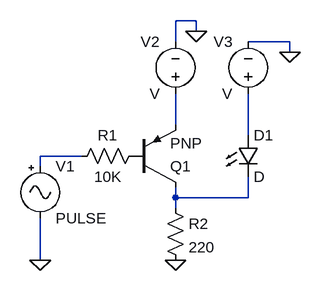
[diagram p0: schematic Draft2.asc]
Draft2.asc, the LTspice schematic file:
Version 4
SHEET 1 880 680
WIRE 240 -80 208 -80
WIRE 240 -64 240 -80
WIRE 208 -48 208 -80
WIRE 384 -48 320 -48
WIRE 384 -32 384 -48
WIRE 208 80 208 32
WIRE 320 96 320 32
WIRE 64 128 0 128
WIRE 0 144 0 128
WIRE 208 192 208 176
WIRE 320 192 320 160
WIRE 320 192 208 192
WIRE 208 208 208 192
WIRE 0 288 0 224
FLAG 208 288 0
FLAG 0 288 0
FLAG 384 -32 0
FLAG 240 -64 0
SYMBOL res 48 144 R270
WINDOW 0 32 56 VTop 2
WINDOW 3 0 56 VBottom 2
SYMATTR InstName R1
SYMATTR Value 10K
SYMBOL res 192 192 R0
SYMATTR InstName R2
SYMATTR Value 220
SYMBOL pnp 144 176 M180
SYMATTR InstName Q1
SYMBOL LED 304 96 R0
SYMATTR InstName D1
SYMBOL Misc\\signal 0 128 R0
WINDOW 123 0 0 Left 0
WINDOW 39 0 0 Left 0
SYMATTR InstName V1
SYMATTR Value PULSE
SYMBOL voltage 208 48 R180
WINDOW 0 24 96 Left 2
WINDOW 3 24 16 Left 2
SYMATTR InstName V2
SYMBOL voltage 320 48 R180
WINDOW 0 24 96 Left 2
WINDOW 3 24 16 Left 2
SYMATTR InstName V3

The netlist it stands for:
* Draft2.asc
R1 N003 P001 10K
R2 N004 0 220
Q1 N004 P001 N001 0 PNP
D1 N002 N004 D
V1 N003 0 PULSE
V2 N001 0 V
V3 N002 0 V
.model D D
.lib standard.dio
.model NPN NPN
.model PNP PNP
.lib standard.bjt
.backanno
.end